# EAGLE design 0350_2Dot8inchLCD (EAGLE 9.6.2)
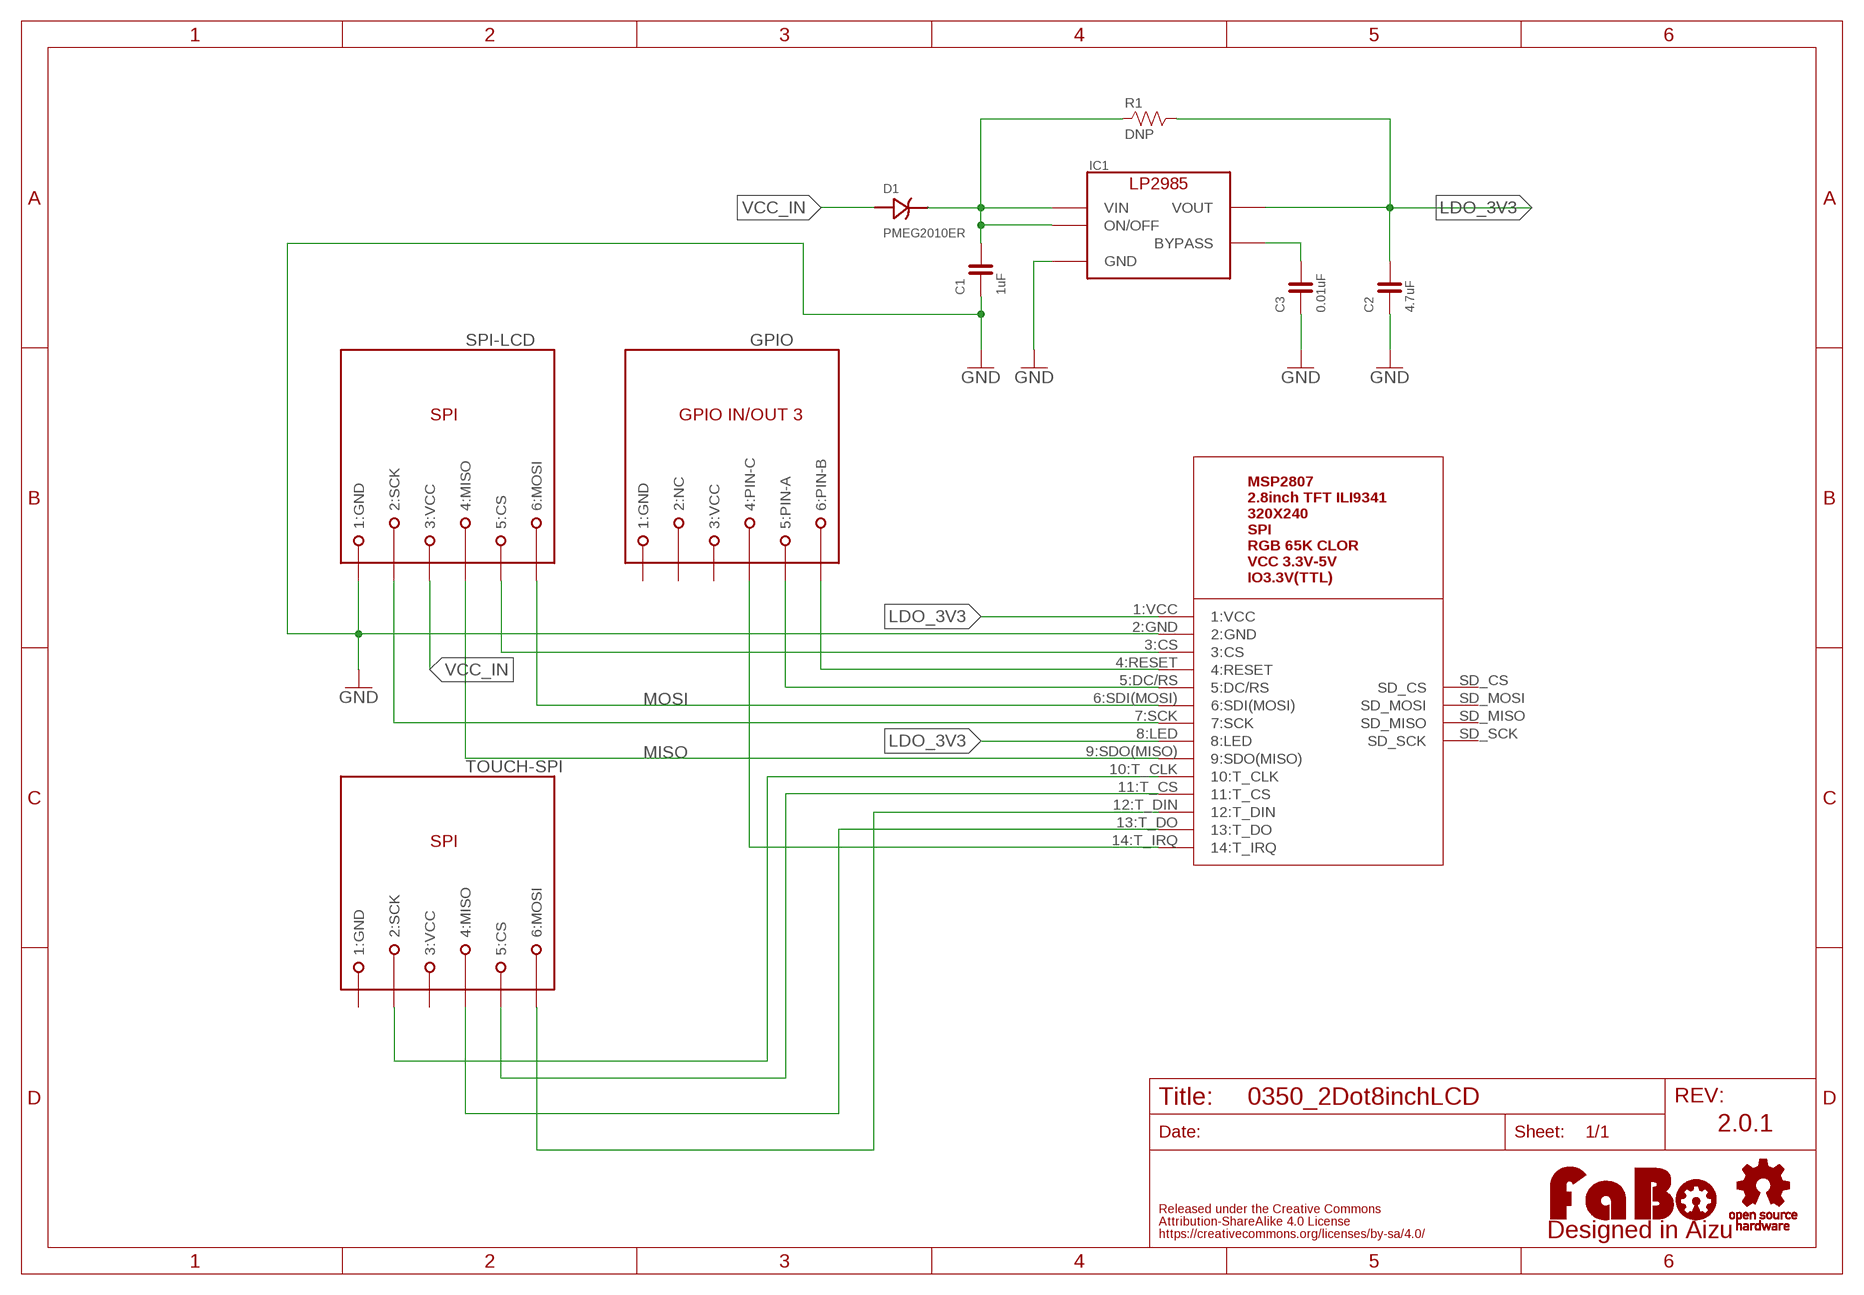
[diagram p0: schematic, sheet 1]

## Parts
C1  1uF  CAPACITOR-0603  [0603]
C2  4.7uF  CAPACITOR-0603  [0603]
C3  0.01uF  CAPACITOR-0603  [0603]
D1  PMEG2010ER  [SOD123W]
GPIO  MODULAR-JACK-6P-RJ11_GPIO3  [7002-6PXC-X]
IC1  LP2985-33DBV  [SOT-23-5]
LOGO1  LOGO_FABO-M_BOTTOM  [LOGO_FABO_M_BOTTOM]
R1  DNP  RESISTOR-0805  [0805]
SPI-LCD  MODULAR-JACK-6P-RJ11_SPI  [7002-6PXC-X]
TOUCH-SPI  MODULAR-JACK-6P-RJ11_SPI  [7002-6PXC-X]
U$3  LOGO_OSHW-M_BOTTOM  [LOGO_OSHW_M_BOTTOM]
U$5  MSP2807(LCD_SPI)  [SPI_LCD_MSP2807]

## Nets
GND: C1.1 C2.1 C3.1 IC1.2(GND) SPI-LCD.1(1:GND) U$5.2:GND
LDO_3V3: C2.2 IC1.5(VOUT) R1.2 U$5.1:VCC U$5.8:LED
MISO: SPI-LCD.4(4:MISO) U$5.9:SDO(MISO)
MOSI: SPI-LCD.6(6:MOSI) U$5.6:SDI(MOSI)
N$1: C1.2 D1.1(CATHODE) IC1.1(VIN) IC1.3(ON/OFF) R1.1
N$2: C3.2 IC1.4(BYPASS)
N$3: SPI-LCD.2(2:SCK) U$5.7:SCK
N$5: SPI-LCD.5(5:CS) U$5.3:CS
N$6: GPIO.6(6:PIN-B) U$5.4:RESET
N$7: GPIO.5(5:PIN-A) U$5.5:DC/RS
N$8: TOUCH-SPI.2(2:SCK) U$5.10:T_CLK
N$9: TOUCH-SPI.5(5:CS) U$5.11:T_CS
N$10: TOUCH-SPI.4(4:MISO) U$5.13:T_DO
N$11: TOUCH-SPI.6(6:MOSI) U$5.12:T_DIN
N$13: GPIO.4(4:PIN-C) U$5.14:T_IRQ
VCC_IN: D1.2(ANODE) SPI-LCD.3(3:VCC)
Unconnected: GPIO.2(2:NC) U$5.SD_CS U$5.SD_MISO U$5.SD_MOSI U$5.SD_SCK

## Notes on the sheet
- 2.0.1

## Power pins joined to a net without a drawn wire
1:GND: GPIO.1(1:GND) TOUCH-SPI.1(1:GND)
3:VCC: GPIO.3(3:VCC) TOUCH-SPI.3(3:VCC)

## Library data of the parts
C1-C3 = FaBo-Capacitor:CAPACITOR: CAPACITOR
D1 = FaBo-Diode:PMEG2010ER
GPIO = FaBo-Connetor:MODULAR-JACK-6P-RJ11_GPIO3
IC1 = FaBo-Supply:LP2985: LP2985
LOGO1 = component:LOGO_FABO
R1 = FaBo-Resistors:RESISTOR: RESISTOR
SPI-LCD TOUCH-SPI = FaBo-Connetor:MODULAR-JACK-6P-RJ11_SPI
U$3 = component:LOGO_OSHW
U$5 = FaBo-Boards:MSP2807(LCD_SPI)

## Board
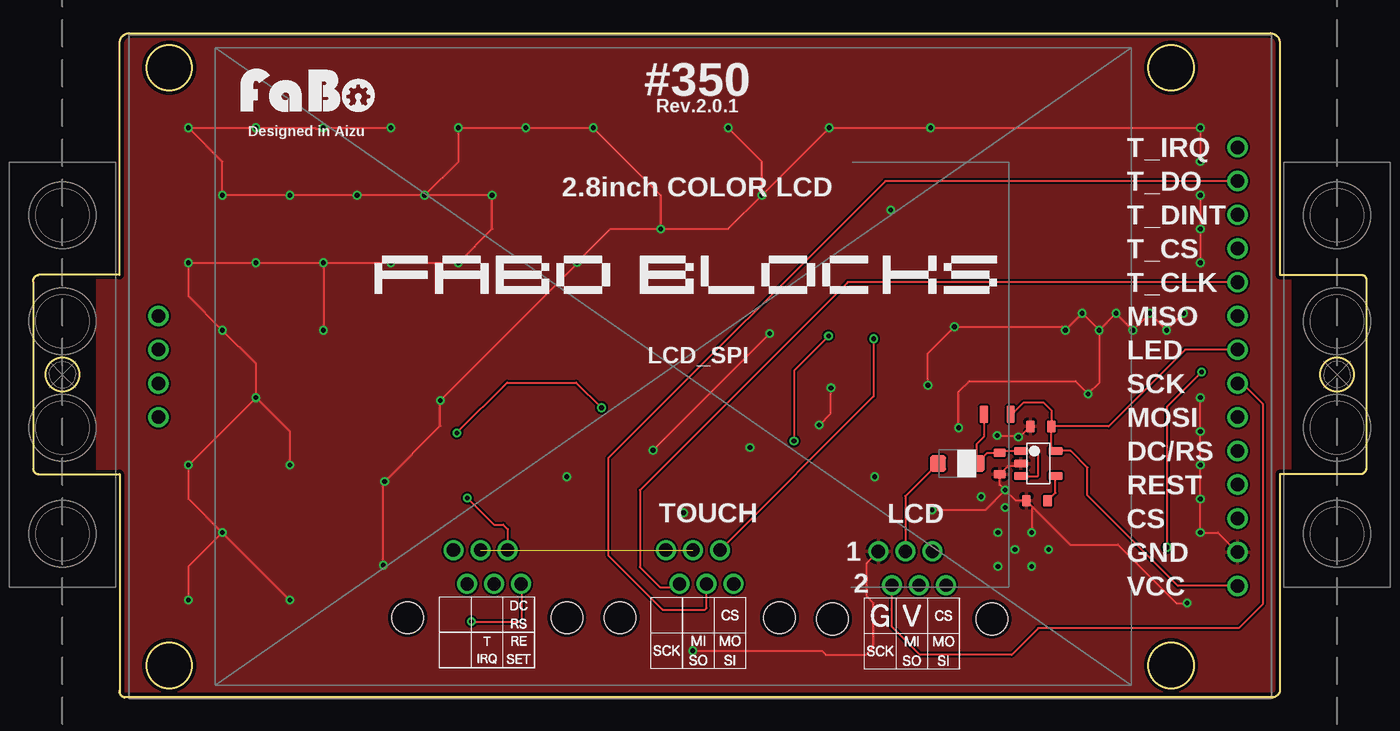
[diagram p1: board, top side]
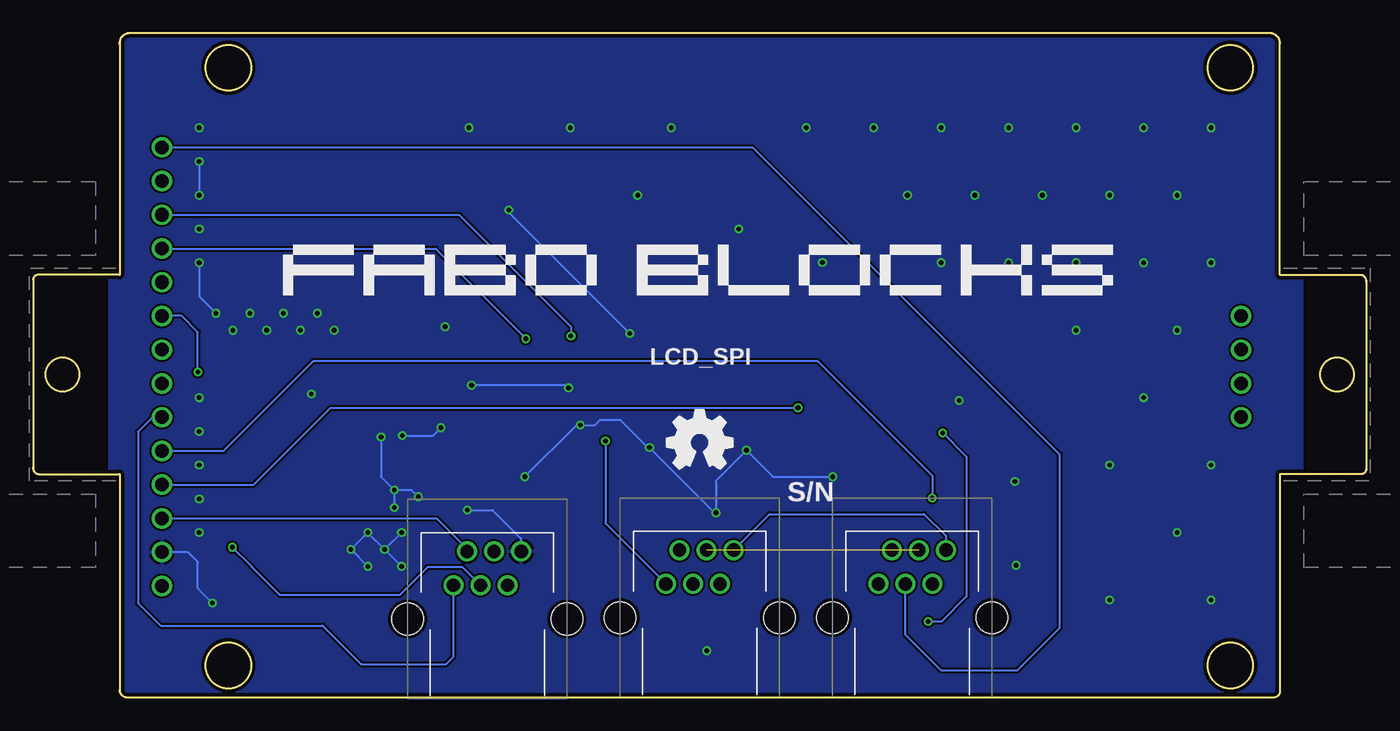
[diagram p2: board, bottom side, seen from below]

Size 100.41 x 50.01 mm. Coordinates in mm from the lower left corner, seen from the top.
Outline: 7.2,50.01 93.2,50.01 arc-90 93.9,49.21 93.9,31.81 100.1,31.81 arc-90 100.4,31.41 100.4,17.31 arc-90 100,16.81 93.9,16.81 93.9,0.51 arc-90 93.2,0.01 6.9,0.01 arc-90 6.5,0.51 6.5,16.81 0.4,16.81 arc-90 0,17.21 0,31.31 arc-90 0.4,31.81 6.5,31.81 6.5,49.21 arc-90 7.2,50.01
Outline: circle at 98.2,24.31 radius 1.27
Outline: circle at 2.2,24.31 radius 1.27
Copper layers (1*16): Top 0.035mm / dielectric 1.6mm / Bottom 0.035mm
Design rules "PCBway": minimum track width 6mil, minimum drill 12mil, track to track 6mil, track to pad 6mil, pad to pad 6mil, via to via 6mil, smd to smd 6mil, copper to edge 10mil, drill to drill 10mil, minimum pad ring 10mil, minimum via ring 6mil, stop-mask expansion 2mil, vias tented up to drill 100mil, thermal gap 8mil
tRestrict: area -1.2,15.6 to 4.7,32.7; area 94.8,15.8 to 100.7,32.9
bRestrict: area -1.2,15.6 to 4.7,32.7; area 94.8,15.8 to 100.7,32.9

### Footprints (pad centres in the part's own frame; a part is rotated, then mirrored left to right if it is on the bottom)
0603 = smd 0.65 x 0.9: 1 -0.8,0; 2 0.8,0
SOD123W = smd 1.2 x 1.2: 1 -1.45,0; 2 1.45,0
7002-6PXC-X = drill 1: 1 2.55,5.08; 2 1.53,2.54; 3 0.51,5.08; 4 -0.51,2.54; 5 -1.53,5.08; 6 -2.55,2.54 | hole 2.4: -6,0; 6,0
SOT-23-5 = smd 0.6 x 1.05: 1 -0.95,-1.3; 2 0,-1.3; 3 0.95,-1.3; 4 0.95,1.3; 5 -0.95,1.3
0805 = smd 0.6 x 1.3: 1 -1,0; 2 1,0
SPI_LCD_MSP2807 = drill 1.02: 1:VCC 0,-16.51; 2:GND 0,-13.97; 3:CS 0,-11.43; 4:RESET 0,-8.89; 5:DC/RS 0,-6.35; 6:SDI(MOSI) 0,-3.81; 7:SCK 0,-1.27; 8:LED 0,1.27; 9:SDO(MISO) 0,3.81; 10:T_CLK 0,6.35; 11:T_CS 0,8.89; 12:T_DIN 0,11.43; 13:T_DO 0,13.97; 14:T_IRQ 0,16.51; SD_CS -81.28,3.81; SD_MISO -81.28,-1.27; SD_MOSI -81.28,1.27; SD_SCK -81.28,-3.81

### Placement (x,y rotation side)
C1  72.8,17.61 90 top
C2  75.9,20.41 0 top
C3  75.6,14.81 0 top
D1  69.6,17.61 180 top
GPIO  34.2,6.01 0 bottom
IC1  75.7,17.61 270 top
LOGO1  20.67,43.71 0 bottom
R1  72.6,21.31 0 top
SPI-LCD  66.2,5.91 0 bottom
TOUCH-SPI  50.2,6.01 0 bottom
U$2  [4-1BLOCK]  2.2,24.31 0 top
U$3  50.2,19.19 0 top
U$4  [4-1BLOCK]  98.2,24.31 180 top
U$5  90.7,24.91 0 top

### Tracks (layer width: path | path; a pad name or v marks a point on that pad's centre or on a via)
1:GND
  Bottom 0.152: TOUCH-SPI.1 44.93,13.81 33.3,13.81 31.65,12.16 GPIO.1
3:VCC  (1 unrouted)
GND  (via drill 0.35)
  Top 0.152: IC1.2 74.2,17.41 73.4,17.41 C1.1 72.8,16.01 v73.2,15.61 | C2.1 74.3,19.61 | 74.3,19.61 v74.2,19.61 | C3.1 74,14.81 v73.2,15.61 | v73.2,15.61 71.7,14.11 v67.7,14.11 | C3.1 78.1,11.51 81.7,11.51 86.1,7.11 v86.9,7.11 | C3.1 75.2,14.41 v75.2,12.41 | v72.6,19.71 74.2,19.71 74.3,19.61 | v11.7,7.33 11.7,9.87 v14.24,12.41 | v14.24,12.41 11.7,14.95 v11.7,17.49 v16.78,22.57 | v16.78,22.57 19.32,20.03 v19.32,17.49 | v16.78,22.57 16.78,25.11 v14.24,27.65 11.7,30.19 v11.7,32.73 v16.78,32.73 v21.86,32.73 | v21.86,32.73 v21.86,27.65 | v21.86,32.73 v26.94,32.73 v32.02,32.73 34.56,35.27 v34.56,37.81 v29.48,37.81 | v29.48,37.81 32.02,40.35 v32.02,42.89 v37.1,42.89 v42.18,42.89 47.26,37.81 v47.26,35.27 | v29.48,37.81 v24.4,37.81 v19.32,37.81 v14.24,37.81 14.24,40.35 v11.7,42.89 v16.78,42.89 21.22,42.89 21.3,42.81 21.78,42.81 v21.86,42.89 v26.94,42.89 | v47.26,35.27 52.34,35.27 v54.88,37.81 | v54.88,37.81 54.88,40.35 v52.34,42.89 | v54.88,37.81 v59.96,42.89 v67.58,42.89 v87.9,42.89 v87.9,40.35 | v80.28,27.65 v79.01,28.92 v77.74,27.65 77.48,27.91 v69.38,27.91 67.38,25.91 v67.38,23.51 | v80.28,27.65 v81.55,28.92 v82.82,27.65 v84.09,28.92 v85.36,27.65 v86.63,28.92 | v80.28,27.65 80.28,23.69 v79.45,22.86 | v79.45,22.86 v79.44,22.85 | v87.9,37.81 v87.9,35.27 v87.9,32.73 | v69.7,20.31 69.7,23.01 70.5,23.81 78.5,23.81 v79.45,22.86 | U$5.2:GND 89.23,12.41 v87.9,12.41 v87.9,14.95 v87.9,17.49 v87.9,20.03 v87.9,22.57 | v19.32,7.33 v14.24,12.41 | v26.36,9.95 26.36,16.15 v26.46,16.25 30.66,20.45 v30.66,22.35 40.96,32.65 v40.96,32.75 43.48,35.27 v47.26,35.27 | v59.2,20.51 60.08,21.39 v60.08,23.31
  Top 0.152: v55.48,27.41 v46.68,18.61 | v49.68,3.51 59.4,3.51 59.7,3.21 62.7,3.21 63.3,3.81 63.3,7.11 62.8,7.61 62.8,10.14 SPI-LCD.1
  Bottom 0.152: v74.2,19.61 74.2,16.61 v73.2,15.61 | v67.7,14.11 65.8,14.11 63.65,11.96 SPI-LCD.1 | v86.9,7.11 88,8.21 88,10.21 88.73,10.94 U$5.2:GND | v73.2,14.31 v73.2,15.61 | v71.4,15.11 71.9,15.61 v73.2,15.61 | v87.9,40.35 v87.9,37.81 | v87.9,32.73 87.9,30.19 v86.63,28.92 | v72.6,19.71 70.3,19.71 v69.7,20.31 | v72.66,9.87 v73.93,11.14 | v73.93,11.14 v72.66,12.41 | v73.93,11.14 v75.2,12.41 v76.47,11.14 v75.2,9.87 | v60.08,23.31 60.28,23.51 v67.38,23.51 | v55.48,27.41 64.58,36.51 v64.58,36.71 | v40.18,16.61 44.68,16.61 v46.68,18.61 48.98,16.31 v48.98,13.91 49.08,13.91 v53.98,18.81 54.1,18.81 56.2,20.91 57.7,20.91 58.1,20.51 v59.2,20.51 59.48,20.51 v63.38,16.61
  pour Bottom (rank 6): -12.1,-7.79 108,-7.79 108,59.61 -12.1,59.61
  pour Top (rank 6): -7.2,-5.39 105.5,-5.39 105.5,57.11 -7.2,57.11
LDO_3V3
  Top 0.152: R1.2 73.7,21.31 74.6,22.21 76.1,22.21 76.7,21.61 C2.2 | C2.2 76.7,18.86 IC1.5 78.15,18.56 79.4,17.31 79.4,15.21 86.21,8.4 U$5.1:VCC | C2.2 81,20.41 86.77,26.18 U$5.8:LED
MISO  (via drill 0.35)
  Top 0.152: v85.4,11.31 85.4,21.91 v88,24.51
  Bottom 0.152: v85.4,11.31 83.95,9.86 83.9,9.81 81.8,7.71 72.8,7.71 70.7,9.81 68.07,9.81 SPI-LCD.4 | v88,24.51 88,27.51 89.21,28.72 U$5.9:SDO(MISO)
MOSI
  Bottom 0.152: U$5.6:SDI(MOSI) 91.41,21.1 92.5,20.01 92.5,7.11 90.8,5.41 78.6,5.41 75.7,2.51 69.3,2.51 68.75,3.06 SPI-LCD.6
N$1
  Top 0.152: IC1.3 75.65,16.66 75.7,16.71 75.7,18.21 75.35,18.56 IC1.1 72.95,18.56 C1.2 71.85,18.41 D1.1 71.05,19.06 71.6,19.61 R1.1
N$2
  Top 0.152: C3.2 77,15.41 IC1.4
N$3
  Top 0.152: U$5.7:SCK 91.07,23.64 92.6,22.11 92.6,7.01 90.8,5.21 75.7,5.21 73.7,3.21 66.8,3.21 64.67,5.34 SPI-LCD.2
N$5
  Bottom 0.152: U$5.3:CS 70.02,13.48 67.73,11.19 SPI-LCD.5
N$6  (via drill 0.35)
  Top 0.152: v31.9,19.91 35.7,23.71 40.9,23.71 v42.8,21.81 | v33,5.71 36.6,5.71 36.8,5.91 36.8,8.5 GPIO.6
  Bottom 0.152: U$5.4:RESET 83.79,16.02 78,21.81 v42.8,21.81 42.7,21.81 | v31.9,19.91 30.1,18.11 30.1,7.61 32,5.71 v33,5.71
N$7  (via drill 0.35)
  Top 0.152: v32.7,15.01 34.7,13.01 35.4,13.01 35.73,12.68 GPIO.5
  Bottom 0.152: U$5.5:DC/RS 86.05,18.56 79.3,25.31 41.3,25.31 32.67,16.68 32.67,15.04 v32.7,15.01
N$8
  Top 0.152: U$5.10:T_CLK 61.35,31.26 45.7,15.61 45.7,9.81 47.2,8.31 48.43,8.31 TOUCH-SPI.2
N$9  (via drill 0.35)
  Top 0.152: TOUCH-SPI.5 63.3,22.66 v63.3,27.01
  Bottom 0.152: U$5.11:T_CS 70.09,33.8 v63.3,27.01
N$10
  Top 0.152: U$5.13:T_DO 64.17,38.88 43.3,18.01 43.3,10.71 47.4,6.61 50.6,6.61 50.71,6.72 TOUCH-SPI.4
N$11  (via drill 0.35)
  Top 0.152: v59.9,27.21 57.3,24.61 v57.3,19.31
  Bottom 0.152: U$5.12:T_DIN 68.33,36.34 59.9,27.91 v59.9,27.21 | TOUCH-SPI.6 57.3,13.1 v57.3,19.31
N$13
  Bottom 0.152: U$5.14:T_IRQ 46.21,41.42 23.1,18.31 23.1,5.21 26.3,2.01 32,2.01 34.71,4.72 GPIO.4
VCC_IN
  Top 0.152: D1.2 65.69,15.15 SPI-LCD.3

### Text on the board
tPlace: #350 | Rev.2.0.1 | Designed in Aizu | T_IRQ | 2.8inch COLOR LCD | T_DO | T_DINT | T_CS | T_CLK | MISO | LCD_SPI | LED | SCK | MOSI | DC/RS | REST | TOUCH | LCD | CS | 1 | GND | 2 | VCC
bPlace: LCD_SPI | S/N
Document: LCD_SPI #350 ES920 FaBo BLOKS Rev2.0.1 / 2022/08/29 ID1